# Altium schematic sheet supercap.SchDoc: SION Supercapacitor Charger
size A4; Organization: UNSW Solar Racing Team; Address3: UNSW; Address4: Sydney NSW 2052; Address2: Electrical Engineering; Address1: Room 342
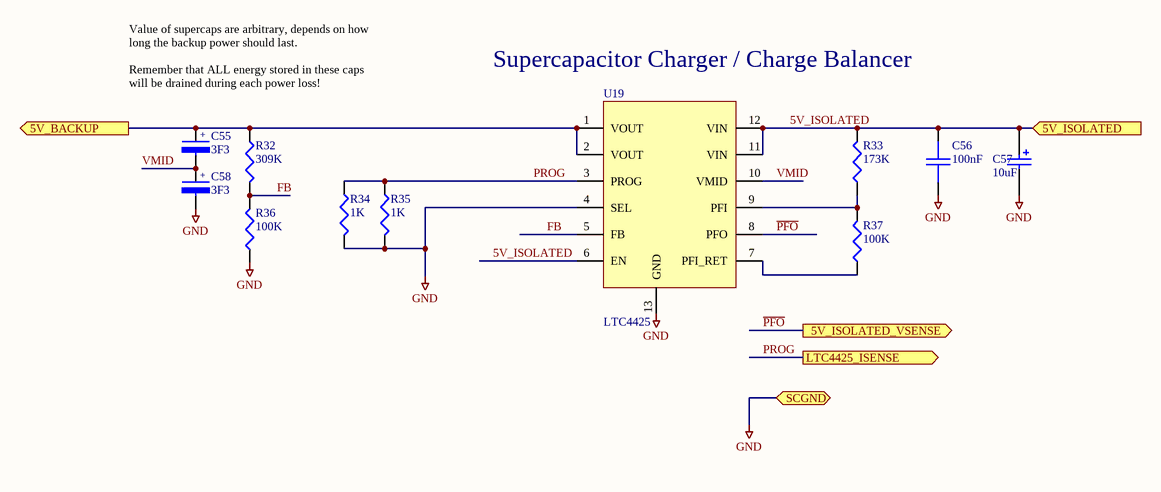
[diagram p0: supercap.SchDoc]

## Parts
C55  3F3  [ELECTROLYTIC-5-32]
C56  100nF  [0603]
C57  10uF  [MCCT-CASEA]
C58  3F3  [ELECTROLYTIC-5-32]
R32  309K  [0603]
R33  173K  [0805]
R34  1K  [0603]
R35  1K  [0603]
R36  100K  [0603]
R37  100K  [0603]
U19  LTC4425  [MS-12]

## Ports
5V_BACKUP (out), 5V_ISOLATED (in), 5V_ISOLATED_VSENSE (out), LTC4425_ISENSE (out), SCGND

## Nets
GND: C56.2 C57.2 C58.2 R34.2 R35.2 R36.1 U19.4(SEL) U19.13(GND) ; port SCGND
5V_BACKUP: C55.1 R32.1 U19.1(VOUT) U19.2(VOUT) ; port 5V_BACKUP
5V_ISOLATED: C56.1 C57.1 R33.2 U19.6(EN) U19.11(VIN) U19.12(VIN) ; port 5V_ISOLATED
FB: R32.2 R36.2 U19.5(FB)
~{PFO}: U19.8(PFO) ; port 5V_ISOLATED_VSENSE
PROG: R34.1 R35.1 U19.3(PROG) ; port LTC4425_ISENSE
VMID: C55.2 C58.1 U19.10(VMID)
NetR33_1: R33.1 R37.2 U19.9(PFI)
NetR37_1: R37.1 U19.7(PFI_RET)

## Notes on the sheet
- Supercapacitor Charger / Charge Balancer
- Value of supercaps are arbitrary, depends on how long the backup power should last.
  Remember that ALL energy stored in these caps will be drained during each power loss!
- Title
- Size:
- Date:
- A4
- Number:
- Time:
- Revision:
- Sheet
- of
- File:
- (in symbol CAP-POL) +

## Library data of the parts
C55 C58 = CAP-POL: Supercap; Notes: Nichicon is preferred - higher voltage.; Digikey: 493-3293-ND; Farnell: 1853360; DigikeyPrice: 3.05; FarnellPrice: 4.15
C56 = CAP: Capacitor
C57 = CAP POL3: Polarized Capacitor (Surface Mount); Revision: July-2002: Re-released for DXP Platform.; Digikey: 399-3687-1-ND; DigikeyPrice: 0.54; Farnell: 1650980; FarnellPrice: 0.786
R32-R37 = RES1: Resistor
  R32: Farnell: 1797157; Digikey: P309KHCT-ND; DigikeyPrice: 0.04; FarnellPrice: 0.559
  R33: FArnell: 1151739; FarnellPrice: 0.157; Digikey: P75.0KHCT-ND; DigikeyPrice: 0.04
  R34 R35: Farnell: 9364366; Digikey: RR08P1.0KDCT-ND; DigikeyPrice: 0.148; FarnellPrice: 0.04
  R36 R37: Farnell: 1344361; FarnellPrice: 0.02; Digikey: CRT0603-BY-1003ELFCT-ND; DigikeyPrice: 0.25
U19 = LTC4425: Supercapacitor Charger; Farnell: 1839114; FarnellPrice: 12.63; Digikey: LTC4425EMSE#PBF-ND; DigikeyPrice: 5.0